# Altium schematic sheet sch_egg-incubator.SchDoc
size A; SheetNumber: 1; SheetTotal: 1
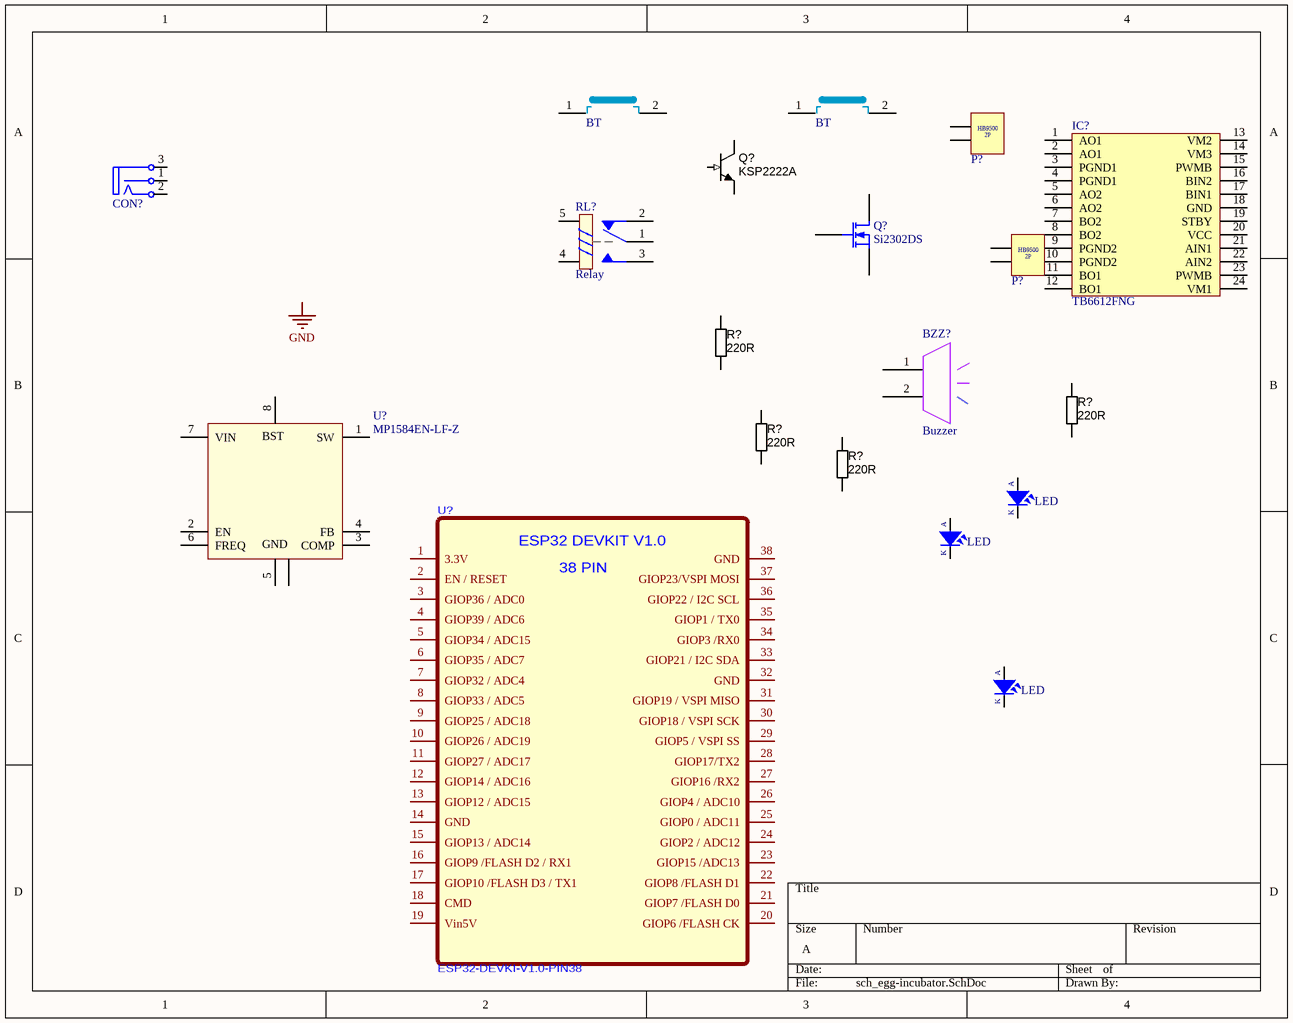
[diagram p0: sch_egg-incubator.SchDoc]

## Parts
(Parts that share a designator on the sheet are numbered #1, #2 ... from top to bottom, then left to right.)
BT?#1  BT  [SW4]
BT?#2  BT  [SW4]
BZZ?  Buzzer  [buzzer 5V]
CON?  CON DC PWR  [CONN/DC/PWR/5.0MM]  (value not drawn)
IC?  TB6612FNG  [TSOP65P760X160-24N]
LED?#1  LED  [LED-3]
LED?#2  LED  [LED-3]
LED?#3  LED  [LED-3]
P?#1  HB9500-2P  [HB9500-2P]  (value not drawn)
P?#2  HB9500-2P  [HB9500-2P]  (value not drawn)
Q?#1  KSP2222A  [TO-92_Flat]
Q?#2  Si2302DS  [SOT23]
R?#1  value 220R  [RESTH_AXIAL-0.4]  (hidden comment: Carbon Film)
R?#2  value 220R  [RESTH_AXIAL-0.4]  (hidden comment: Carbon Film)
R?#3  value 220R  [RESTH_AXIAL-0.4]  (hidden comment: Carbon Film)
R?#4  value 220R  [RESTH_AXIAL-0.4]  (hidden comment: Carbon Film)
RL?  Relay  [RL_SPDT_10A]
U?#1  MP1584EN-LF-Z  [SOIC-8 EP]
U?#2  ESP32-DEVKI-V1.0-PIN38  [ESP32-DEVKIT-V1.0-38PIN]

## Nets

Not connected (* = marked no-connect by the designer): BT?#1 1 2; BT?#2 1 2; BZZ? 1 2; CON? 1(S) 2(T) 3(TN); IC? 1(AO1) 2(AO1) 3(PGND1) 4(PGND1) 5(AO2) 6(AO2) 7(BO2) 8(BO2) 9(PGND2) 10(PGND2) 11(BO1) 12(BO1) 13(VM2) 14(VM3) 15(PWMB) 16(BIN2) 17(BIN1) 18(GND) 19(STBY) 20(VCC) 21(AIN1) 22(AIN2) 23(PWMB) 24(VM1); LED?#1 1(A) 2(K); LED?#2 1(A) 2(K); LED?#3 1(A) 2(K); P?#1 1 2; P?#2 1 2; Q?#1 1(E) 2(B) 3(C); Q?#2 1(G) 2(S) 3(D); R?#1 1 2; R?#2 1 2; R?#3 1 2; R?#4 1 2; RL? 1 2 3 4 5; U?#1 1(SW) 2(EN) 3(COMP) 4(FB) 5(GND) 6(FREQ) 7(VIN) 8(BST) 9(PAD); U?#2 1(3.3V) 2(EN_/_RESET) 3(GIOP36_/_ADC0) 4(GIOP39_/_ADC6) 5(GIOP34_/_ADC15) 6(GIOP35_/_ADC7) 7(GIOP32_/_ADC4) 8(GIOP33_/_ADC5) 9(GIOP25_/_ADC18) 10(GIOP26_/_ADC19) 11(GIOP27_/_ADC17) 12(GIOP14_/_ADC16) 13(GIOP12_/_ADC15) 14(GND) 15(GIOP13_/_ADC14) 16(GIOP9_/FLASH_D2_/_RX1) 17(GIOP10_/FLASH_D3_/_TX1) 18(CMD) 19(Vin5V) 20(GIOP6_/FLASH_CK) 21(GIOP7_/FLASH_D0) 22(GIOP8_/FLASH_D1) 23(GIOP15_/ADC13) 24(GIOP2_/_ADC12) 25(GIOP0_/_ADC11) 26(GIOP4_/_ADC10) 27(GIOP16_/RX2) 28(GIOP17/TX2) 29(GIOP5_/_VSPI_SS) 30(GIOP18_/_VSPI_SCK) 31(GIOP19_/_VSPI_MISO) 32(GND) 33(GIOP21_/_I2C_SDA) 34(GIOP3_/RX0) 35(GIOP1_/_TX0) 36(GIOP22_/_I2C_SCL) 37(GIOP23/VSPI_MOSI) 38(GND)

## Notes on the sheet
- Labels drawn without touching a wire or pin: GND
- (in symbol ESP32-DEVKI-V1.0-PIN38) ESP32 DEVKIT V1.0; 38 PIN
- (in symbol HB9500-2P) HB9500; 2P

## Library data of the parts
BT?#1 BT?#2 = BUTTON
CON? = CON DC PWR: DC input connector
LED?#1-LED?#3 = LED: LED Single colour Green and Red; Value: LED 3 ly Single Colour
P?#1 P?#2 = HB9500-2P: Terminal Block, Header, 2P, 15A, 300VAC Rohs Compliant: Yes
Q?#1 = NPN_KSP2222A: Transistor SMD NPN 40V 0.6A 625mW TO-92; Manufacturer 1: Fairchild Semiconductor; Manufacturer Part Number 1: KSP2222ATF; Ratings: 40V; 0.6A; 625mW; Material: Si; SCDType: source; Package / Case: TO-92-3; Value: NPN; Mounting Type: Thru-hole; Supplier 1: Digi-Key; Supplier Part Number 1: KSP2222ATF-ND; Supplier 2: Digi-Key; Supplier Part Number 2: PN2222AD26ZTR-ND; Manufacturer 2: Fairchild Semiconductor; Manufacturer Part Number 2: PN2222ATFR; Supplier 3: Digi-Key; Supplier Part Number 3: MPS2222ARLGOSTR-ND; Manufacturer 3: ON Semiconductor; Manufacturer Part Number 3: MPS2222ARLG
Q?#2 = Si2302DS: N-Channel MOSFET; Published: 8-Jun-2000; LatestRevisionDate: 17-Jul-2002; LatestRevisionNote: Re-released for DXP Platform.; PackageVersion: 1995/1996; PackageReference: E3; Publisher: Altium Limited; PackageDescription: TO, Flat Index; 3 In-Line, Axial Leads; Body Dia. 4.6mm; Lead Dia. 0.5 mm (max)
R?#1-R?#4 = RES_Axial_0.25W: Resistor THD Axial 220 Ohm 0.25W 5% Carbon Film; Manufacturer 1: Yageo; Manufacturer Part Number 1: CFR-25JB-220R; Ratings: 1/4W; SCDType: spec; Tolerance: ±5%; Package / Case: Axial; Supplier 1: Digi-Key; Supplier Part Number 1: 220QBK-ND
RL? = Relay SRD: Relay SPDT 5 Pin; Value: Relay SPDT, 10A, 12V
U?#1 = MP1584EN-LF-Z: IC REG BUCK ADJUSTABLE 3A 8SOIC; PART NO: UCC28720DR; BRAND: TI; STOCK CODE: 296-41058-1-ND; SUPPLIER: Digi-Key; TYPE: SMD; PACKAGE: SOIC7